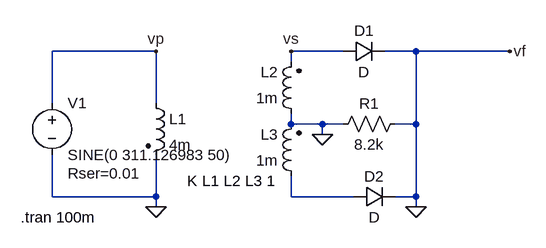
[diagram p0: schematic centre-tap.asc]
centre-tap.asc, the LTspice schematic file:
Version 4
SHEET 1 880 680
WIRE 160 64 0 64
WIRE 448 64 368 64
WIRE 560 64 512 64
WIRE 704 64 560 64
WIRE 368 80 368 64
WIRE 0 144 0 64
WIRE 160 144 160 64
WIRE 368 176 368 160
WIRE 416 176 368 176
WIRE 448 176 416 176
WIRE 560 176 560 64
WIRE 560 176 528 176
WIRE 416 192 416 176
WIRE 0 288 0 224
WIRE 160 288 160 224
WIRE 160 288 0 288
WIRE 368 288 368 256
WIRE 464 288 368 288
WIRE 560 288 560 176
WIRE 560 288 528 288
WIRE 160 304 160 288
WIRE 560 304 560 288
FLAG 160 304 0
FLAG 160 64 vp
FLAG 368 64 vs
FLAG 704 64 vf
FLAG 416 192 0
FLAG 560 304 0
SYMBOL voltage 0 128 R0
WINDOW 123 0 0 Left 0
WINDOW 39 24 124 Left 2
SYMATTR SpiceLine Rser=0.01
SYMATTR InstName V1
SYMATTR Value SINE(0 311.126983 50)
SYMBOL ind2 144 128 R0
SYMATTR InstName L1
SYMATTR Value 4m
SYMATTR Type ind
SYMBOL diode 448 80 R270
WINDOW 0 32 32 VTop 2
WINDOW 3 0 32 VBottom 2
SYMATTR InstName D1
SYMBOL diode 464 304 R270
WINDOW 0 32 32 VTop 2
WINDOW 3 0 32 VBottom 2
SYMATTR InstName D2
SYMBOL ind2 384 176 R180
WINDOW 0 36 80 Left 2
WINDOW 3 36 40 Left 2
SYMATTR InstName L2
SYMATTR Value 1m
SYMATTR Type ind
SYMBOL ind2 384 272 R180
WINDOW 0 36 80 Left 2
WINDOW 3 36 40 Left 2
SYMATTR InstName L3
SYMATTR Value 1m
SYMATTR Type ind
SYMBOL res 544 160 R90
WINDOW 0 0 56 VBottom 2
WINDOW 3 32 56 VTop 2
SYMATTR InstName R1
SYMATTR Value 8.2k
TEXT -48 320 Left 2 !.tran 100m
TEXT 208 264 Left 2 !K L1 L2 L3 1

The netlist it stands for:
* centre-tap.asc
V1 vp 0 SINE(0 311.126983 50) Rser=0.01
L1 vp 0 4m
D1 vs 0 D
D2 N001 0 D
L2 0 vs 1m
L3 N001 0 1m
R1 0 0 8.2k
.model D D
.lib standard.dio
.tran 100m
K L1 L2 L3 1
.backanno
.end